# EAGLE design Rotary Phone Reader (EAGLE 6.5.0)
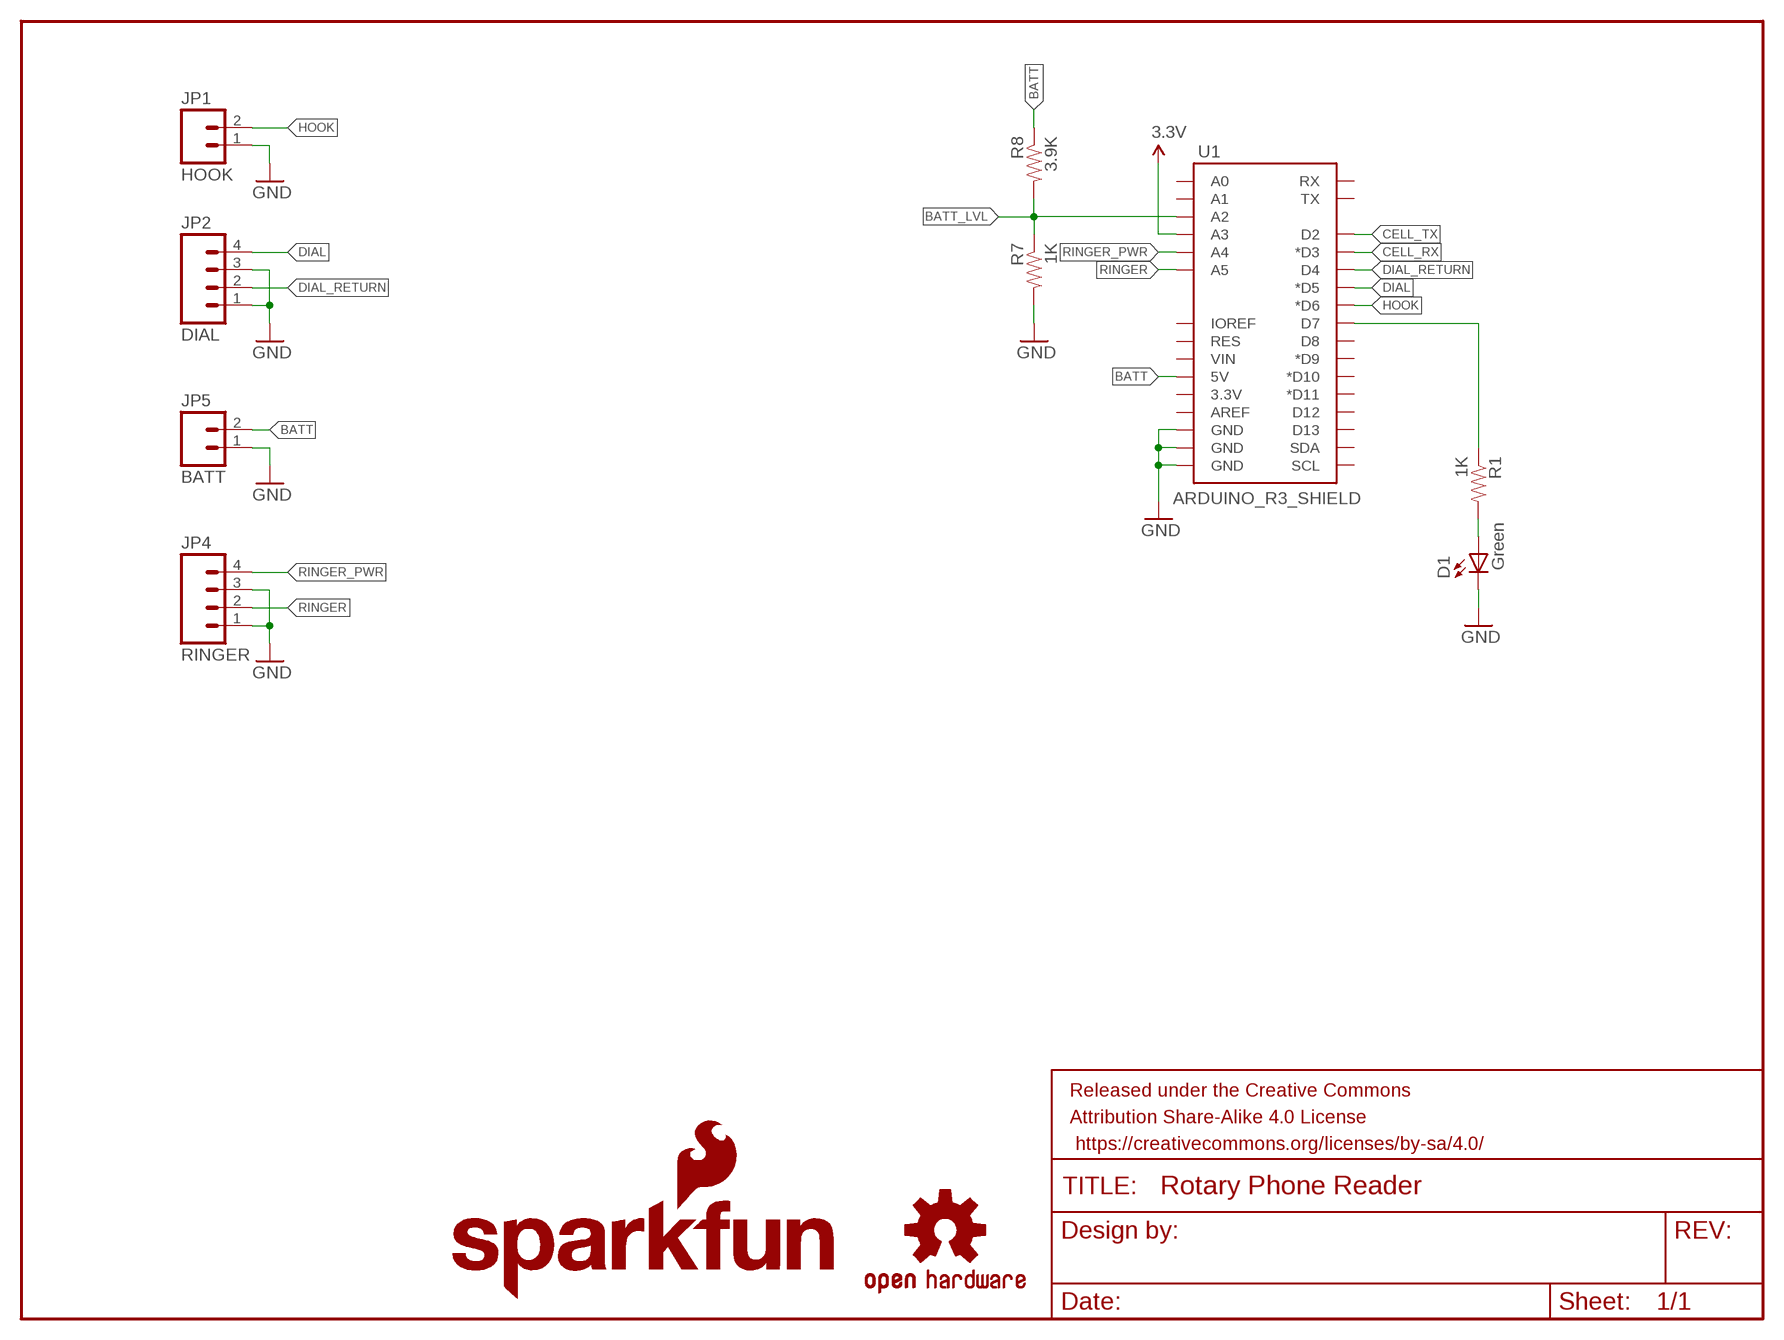
[diagram p0: schematic, sheet 1]

## Parts
D1  Green  LED5MM  [LED5MM]
FRAME1  FRAME-LETTER  [CREATIVE_COMMONS]
JP1  HOOK  M02JST-PTH-2  [JST-2-PTH]
JP2  DIAL  M04JST-PTH  [JST-4-PTH]
JP4  RINGER  M04JST-PTH  [JST-4-PTH]
JP5  BATT  M02JST-PTH-2  [JST-2-PTH]
LOGO1  SFE_LOGO_NAME_FLAME.1_INCH  [SFE_LOGO_NAME_FLAME_.1]
R1  1K  RESISTORPTH-1/4W  [AXIAL-0.4]
R7  1K  RESISTORPTH-1/4W  [AXIAL-0.4]
R8  3.9K  RESISTORPTH-1/4W  [AXIAL-0.4]
U1  ARDUINO_R3_SHIELD  [UNO_R3_SHIELD]
U$7  OSHW-LOGOS  [OSHW-LOGO-S]

## Nets
3.3V: U1.A3
BATT: JP5.2 R8.P$1 U1.5V
BATT_LVL: R7.P$1 R8.P$2 U1.A2
CELL_RX: U1.D3(*D3)
CELL_TX: U1.D2
DIAL: JP2.4 U1.D5(*D5)
DIAL_RETURN: JP2.2 U1.D4
GND [vcc]: D1.K(C) JP1.1 JP2.1 JP2.3 JP4.1 JP4.3 JP5.1 R7.P$2 U1.GND@0(GND) U1.GND@1(GND) U1.GND@2(GND)
HOOK: JP1.2 U1.D6(*D6)
N$3: D1.A R1.P$2
RINGER: JP4.2 U1.A5
RINGER_PWR: JP4.4 U1.A4
STAT1: R1.P$1 U1.D7
Unconnected: U1.3.3V U1.A0 U1.A1 U1.AREF U1.D8 U1.D9(*D9) U1.D10(*D10) U1.D11(*D11) U1.D12 U1.D13 U1.IOREF U1.RES U1.RX U1.SCL U1.SDA U1.TX U1.VIN

## Library data of the parts
D1 = SparkFun:LED: LEDs Standard schematic elements and footprints for 5mm, 3mm, 1206, and 0603 sized LEDs. 5mm - Spark Fun Electronics SKU : COM-00529 (and others)
FRAME1 = SparkFun-Aesthetics:FRAME-LETTER: Schematic Frame Standard 8.5x11 US Letter frame
JP1 JP5 = SparkFun-Connectors:M02: Standard 2-pin 0.1" header. Use with - straight break away headers ( PRT-00116) - right angle break away headers (PRT-00553) - swiss pins (PRT-00743) - machine pins (PRT-00117) - female headers (PRT-00115) Molex polarized connector foot print use with: PRT-08233 with associated crimp pins and housings. 2.54_SCREWTERM for use with PRT-10571. 3.5mm Screw Terminal footprints for PRT-08084 5mm Screw Terminal footprints for use with PRT-08432; SKU: PRT-09914
JP2 JP4 = SparkFun-Connectors:M04: Header 4 Standard 4-pin 0.1" header. Use with straight break away headers (SKU : PRT-00116), right angle break away headers (PRT-00553), swiss pins (PRT-00743), machine pins (PRT-00117), and female headers (PRT-00115). Molex polarized connector foot print use with SKU : PRT-08231 with associated crimp pins and housings. 1MM SMD Version SKU: PRT-10208; SKU: PRT-09916
LOGO1 = SparkFun-Aesthetics:SFE_LOGO_NAME_FLAME: SFE Logo, name and flame This is the SparkFun full logo. The logo on the schematic will always be the same size; the package variant is the height of the flame part of the logo. Default layer for the logo on the board is tSilk.
R1 R7 R8 = SparkFun:RESISTOR: Resistor Basic schematic elements and footprints for 0603, 1206, and PTH resistors.
U1 = SparkFun-Boards:ARDUINO_R3_SHIELD: Shield form compatible with the Arduino Uno R3.
U$7 = SparkFun-Aesthetics:OSHW-LOGO: Open Source Hardware Logo This logo indicates the piece of hardware it is found on incorporates a OSHW license and/or adheres to the definition of open source hardware found here: http://freedomdefined.org/OSHW

## Net classes
0 Default: width 0.203 mm
1 vcc: width 0.203 mm

## Board
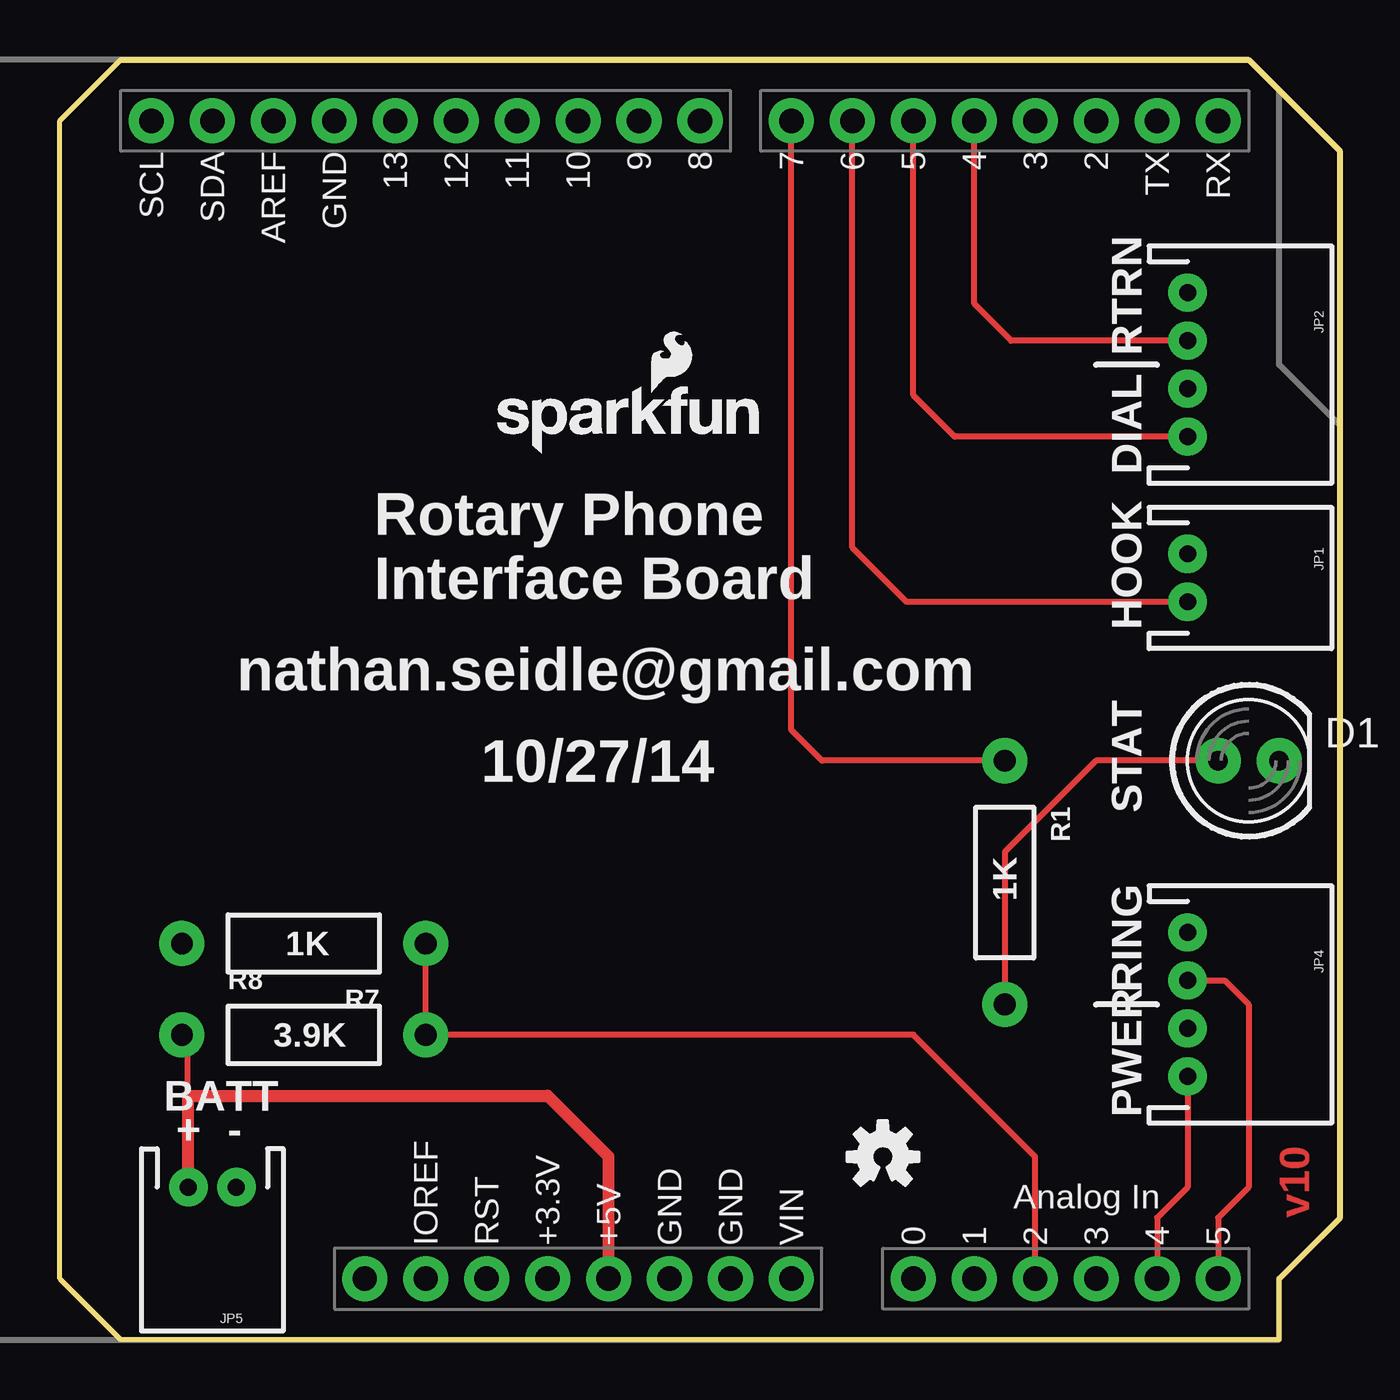
[diagram p1: board, top side]
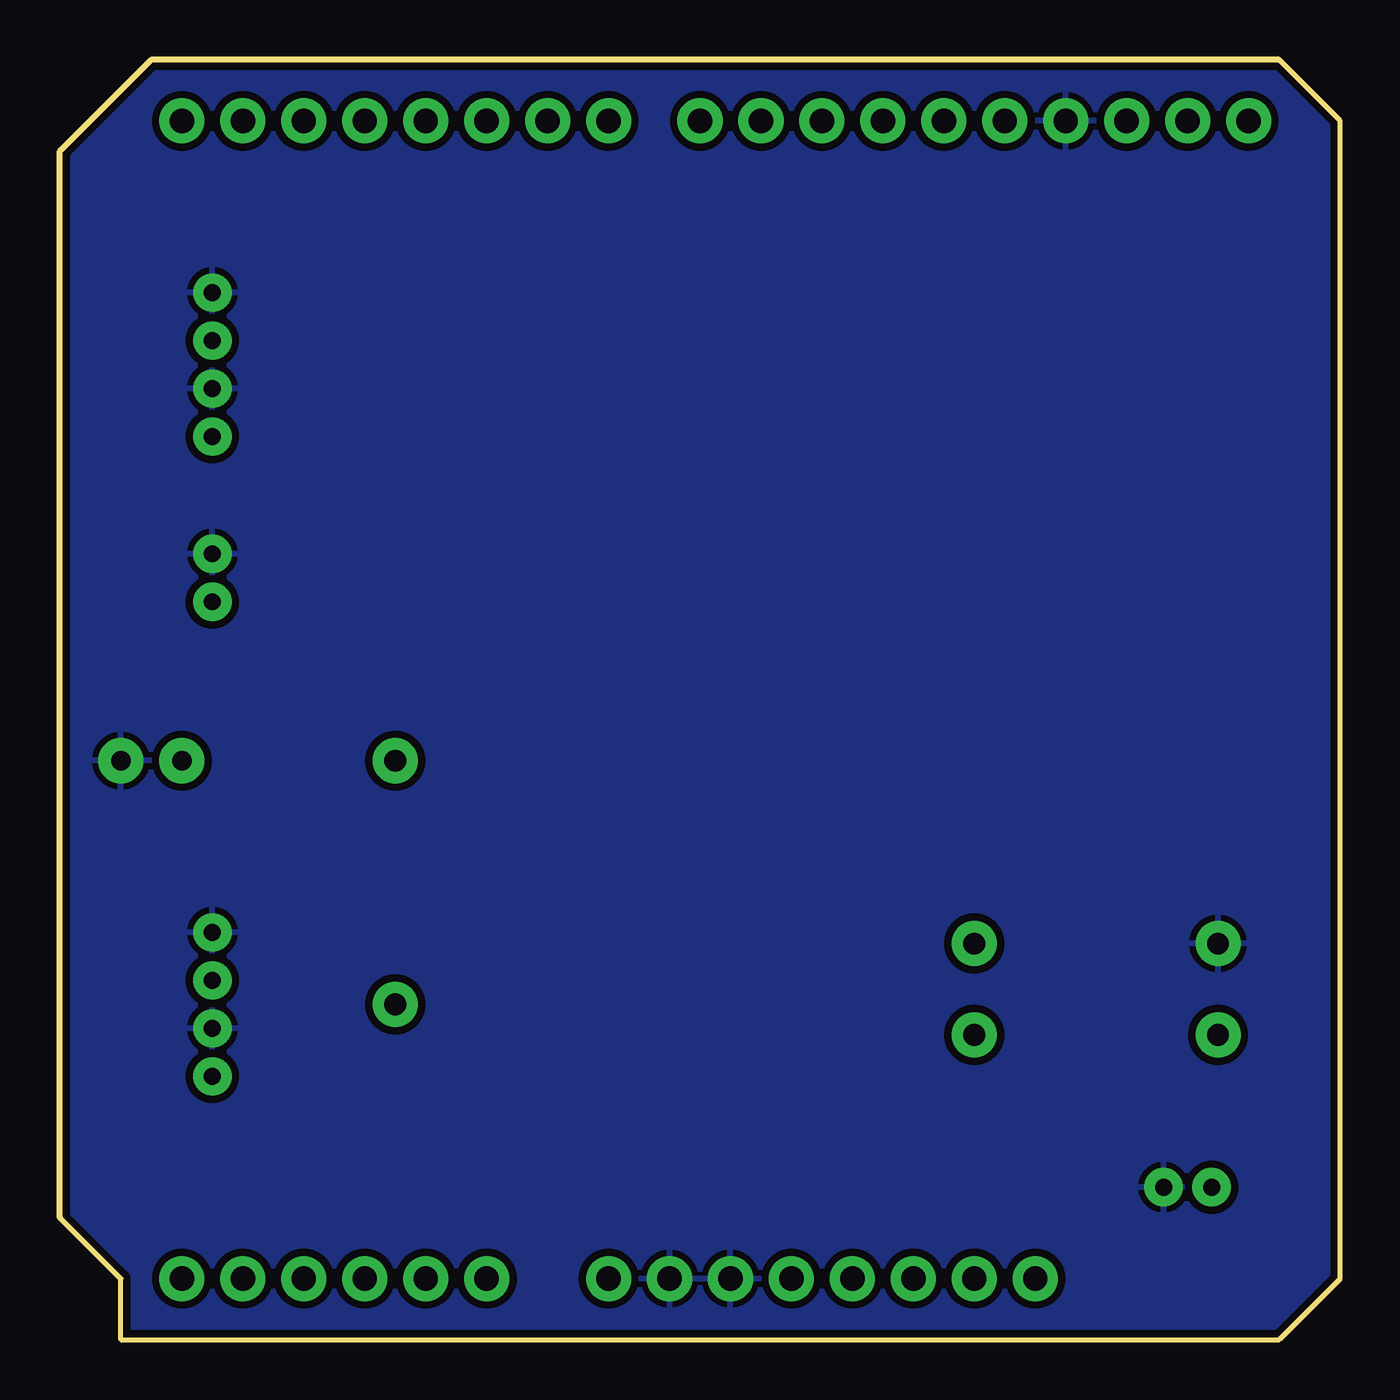
[diagram p2: board, bottom side, seen from below]

Size 53.34 x 53.34 mm. Coordinates in mm from the lower left corner, seen from the top.
Outline: 2.54,53.34 49.53,53.34 53.34,49.53 53.34,5.08 50.8,2.54 50.8,0 2.54,0 0,2.54 0,50.8 2.54,53.34
Copper layers (1*16): Top 0.035mm / dielectric 1.5mm / Bottom 0.035mm
Design rules "default *": minimum track width 8mil, minimum drill 20mil, track to track 8mil, track to pad 8mil, pad to pad 8mil, via to via 8mil, smd to smd 8mil, copper to edge 8mil, drill to drill 8mil, minimum pad ring 12mil, minimum via ring 10mil, stop-mask expansion 4mil, vias tented up to drill 20mil, thermal gap 10mil

### Footprints (pad centres in the part's own frame; a part is rotated, then mirrored left to right if it is on the bottom)
LED5MM = drill 0.813 pad 1.88: A -1.27,0; K 1.27,0
JST-2-PTH = drill 0.7 pad 1.6: 1 -1,0; 2 1,0
JST-4-PTH = drill 0.7 pad 1.6: 1 -3,0; 2 -1,0; 3 1,0; 4 3,0
AXIAL-0.4 = drill 0.9 pad 1.88: P$1 -5.08,0; P$2 5.08,0
UNO_R3_SHIELD = drill 1.016 pad 1.88: 3.3V 50.8,26.67; 5V 50.8,29.21; A0 50.8,41.91; A1 50.8,44.45; A2 50.8,46.99; A3 50.8,49.53; A4 50.8,52.07; A5 50.8,54.61; AREF 2.54,15.24; D2 2.54,49.53; D3 2.54,46.99; D4 2.54,44.45; D5 2.54,41.91; D6 2.54,39.37; D7 2.54,36.83; D8 2.54,33.02; D9 2.54,30.48; D10 2.54,27.94; D11 2.54,25.4; D12 2.54,22.86; D13 2.54,20.32; GND@0 50.8,31.75; GND@1 50.8,34.29; GND@2 2.54,17.78; IOREF 50.8,21.59; NC 50.8,19.05; RES 50.8,24.13; RX 2.54,54.61; SCL 2.54,10.16; SDA 2.54,12.7; TX 2.54,52.07; VIN 50.8,36.83

### Placement (x,y rotation side)
D1  49.53,24.13 0 top
FRAME1  -7,-21.59 0 top  (outside the outline)
JP1  46.99,31.75 270 top
JP2  46.99,40.64 270 top
JP4  46.99,13.97 270 top
JP5  6.35,6.35 180 top
LOGO1  17.78,36.83 0 top
R1  39.37,19.05 270 top
R7  10.16,16.51 180 top
R8  10.16,12.7 0 top
U1  -6.35,53.34 270 top
U$7  34.29,7.62 0 top

### Tracks (layer width: path | path; a pad name or v marks a point on that pad's centre or on a via)
BATT
  Top 0.254: 5.33,10.16 5.33,12.45 R8.P$1
  Top 0.508: U1.5V 22.86,7.62 20.32,10.16 5.33,10.16 5.35,10.14 JP5.2
BATT_LVL
  Top 0.254: U1.A2 40.64,7.62 35.56,12.7 R8.P$2 R7.P$1
DIAL
  Top 0.254: JP2.4 37.29,37.64 35.56,39.37 U1.D5
DIAL_RETURN
  Top 0.254: JP2.2 39.64,41.64 38.1,43.18 U1.D4
GND
  pour Bottom (isolate 0.305): 0,53.34 49.53,53.34 53.34,49.53 53.34,0 0,0
HOOK
  Top 0.254: JP1.2 35.29,30.75 33.02,33.02 U1.D6
N$3
  Top 0.254: D1.A 43.18,24.13 39.37,20.32 R1.P$2
RINGER
  Top 0.254: JP4.2 48.53,14.97 49.53,13.97 49.53,6.35 48.26,5.08 U1.A5
RINGER_PWR
  Top 0.254: JP4.4 46.99,6.35 45.72,5.08 U1.A4
STAT1
  Top 0.254: R1.P$1 31.75,24.13 30.48,25.4 U1.D7

### Text on the board
Top: v10
tPlace: RTRN | DIAL | Rotary Phone / Interface Board | HOOK | nathan.seidle@gmail.com | 10/27/14 | STAT | RING | BATT | PWER | + | -